# Altium schematic sheet README.SchDoc: FMC-320U - MODELO A - PCB 1
size A4; SheetNumber: 1; SheetTotal: 7; thisVersion: 1; ThisRevision: 2; ThisRelease: 1
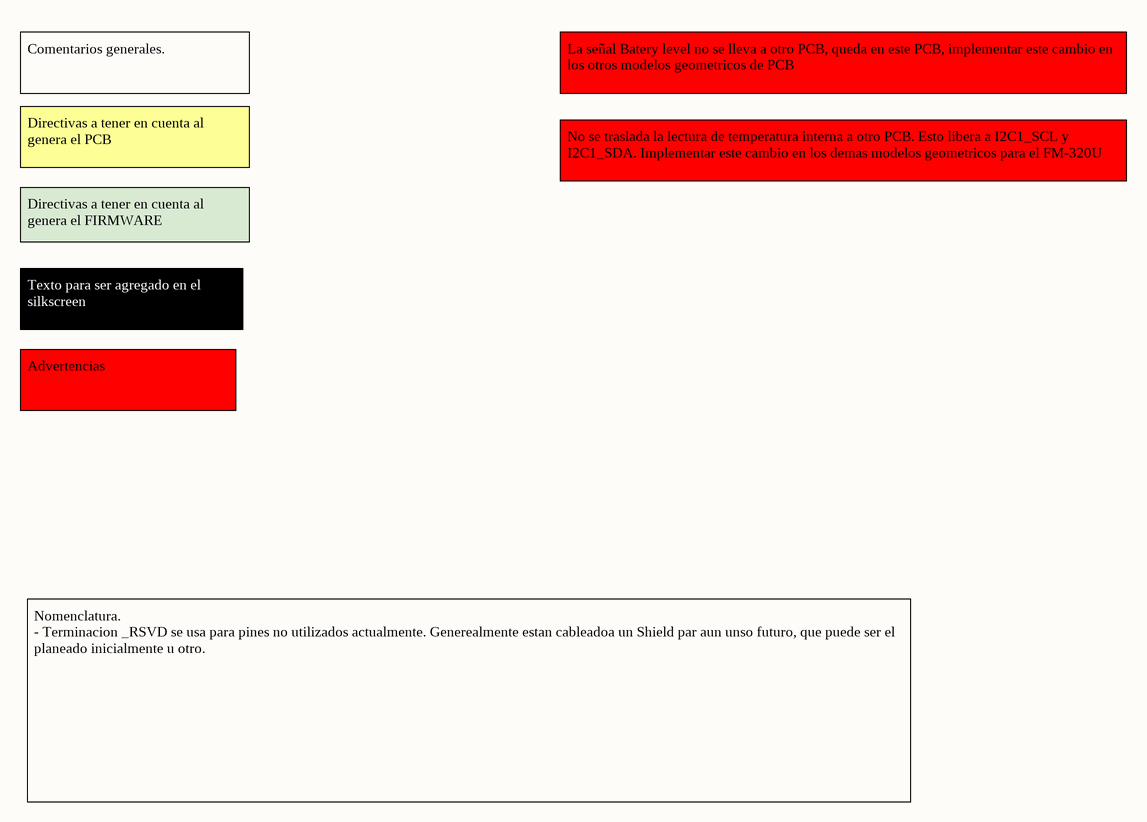
[diagram p0: README.SchDoc]

## Notes on the sheet
- Comentarios generales.
- La señal Batery level no se lleva a otro PCB, queda en este PCB, implementar este cambio en los otros modelos geometricos de PCB
- Directivas a tener en cuenta al genera el PCB
- No se traslada la lectura de temperatura interna a otro PCB. Esto libera a I2C1_SCL y I2C1_SDA. Implementar este cambio en los demas modelos geometricos para el FM-320U
- Directivas a tener en cuenta al genera el FIRMWARE
- Texto para ser agregado en el silkscreen
- Advertencias
- Nomenclatura.
  - Terminacion _RSVD se usa para pines no utilizados actualmente. Generealmente estan cableadoa un Shield par aun unso futuro, que puede ser el planeado inicialmente u otro.
- Title:
- Size: A4
- Date:
- Sheet:
- Time:
- Of:
- Version:
- Revision:
- Release:
- FLOWMEET SRL
- File